# Altium schematic sheet rev02_4.SchDoc
size 409 x 282 mm
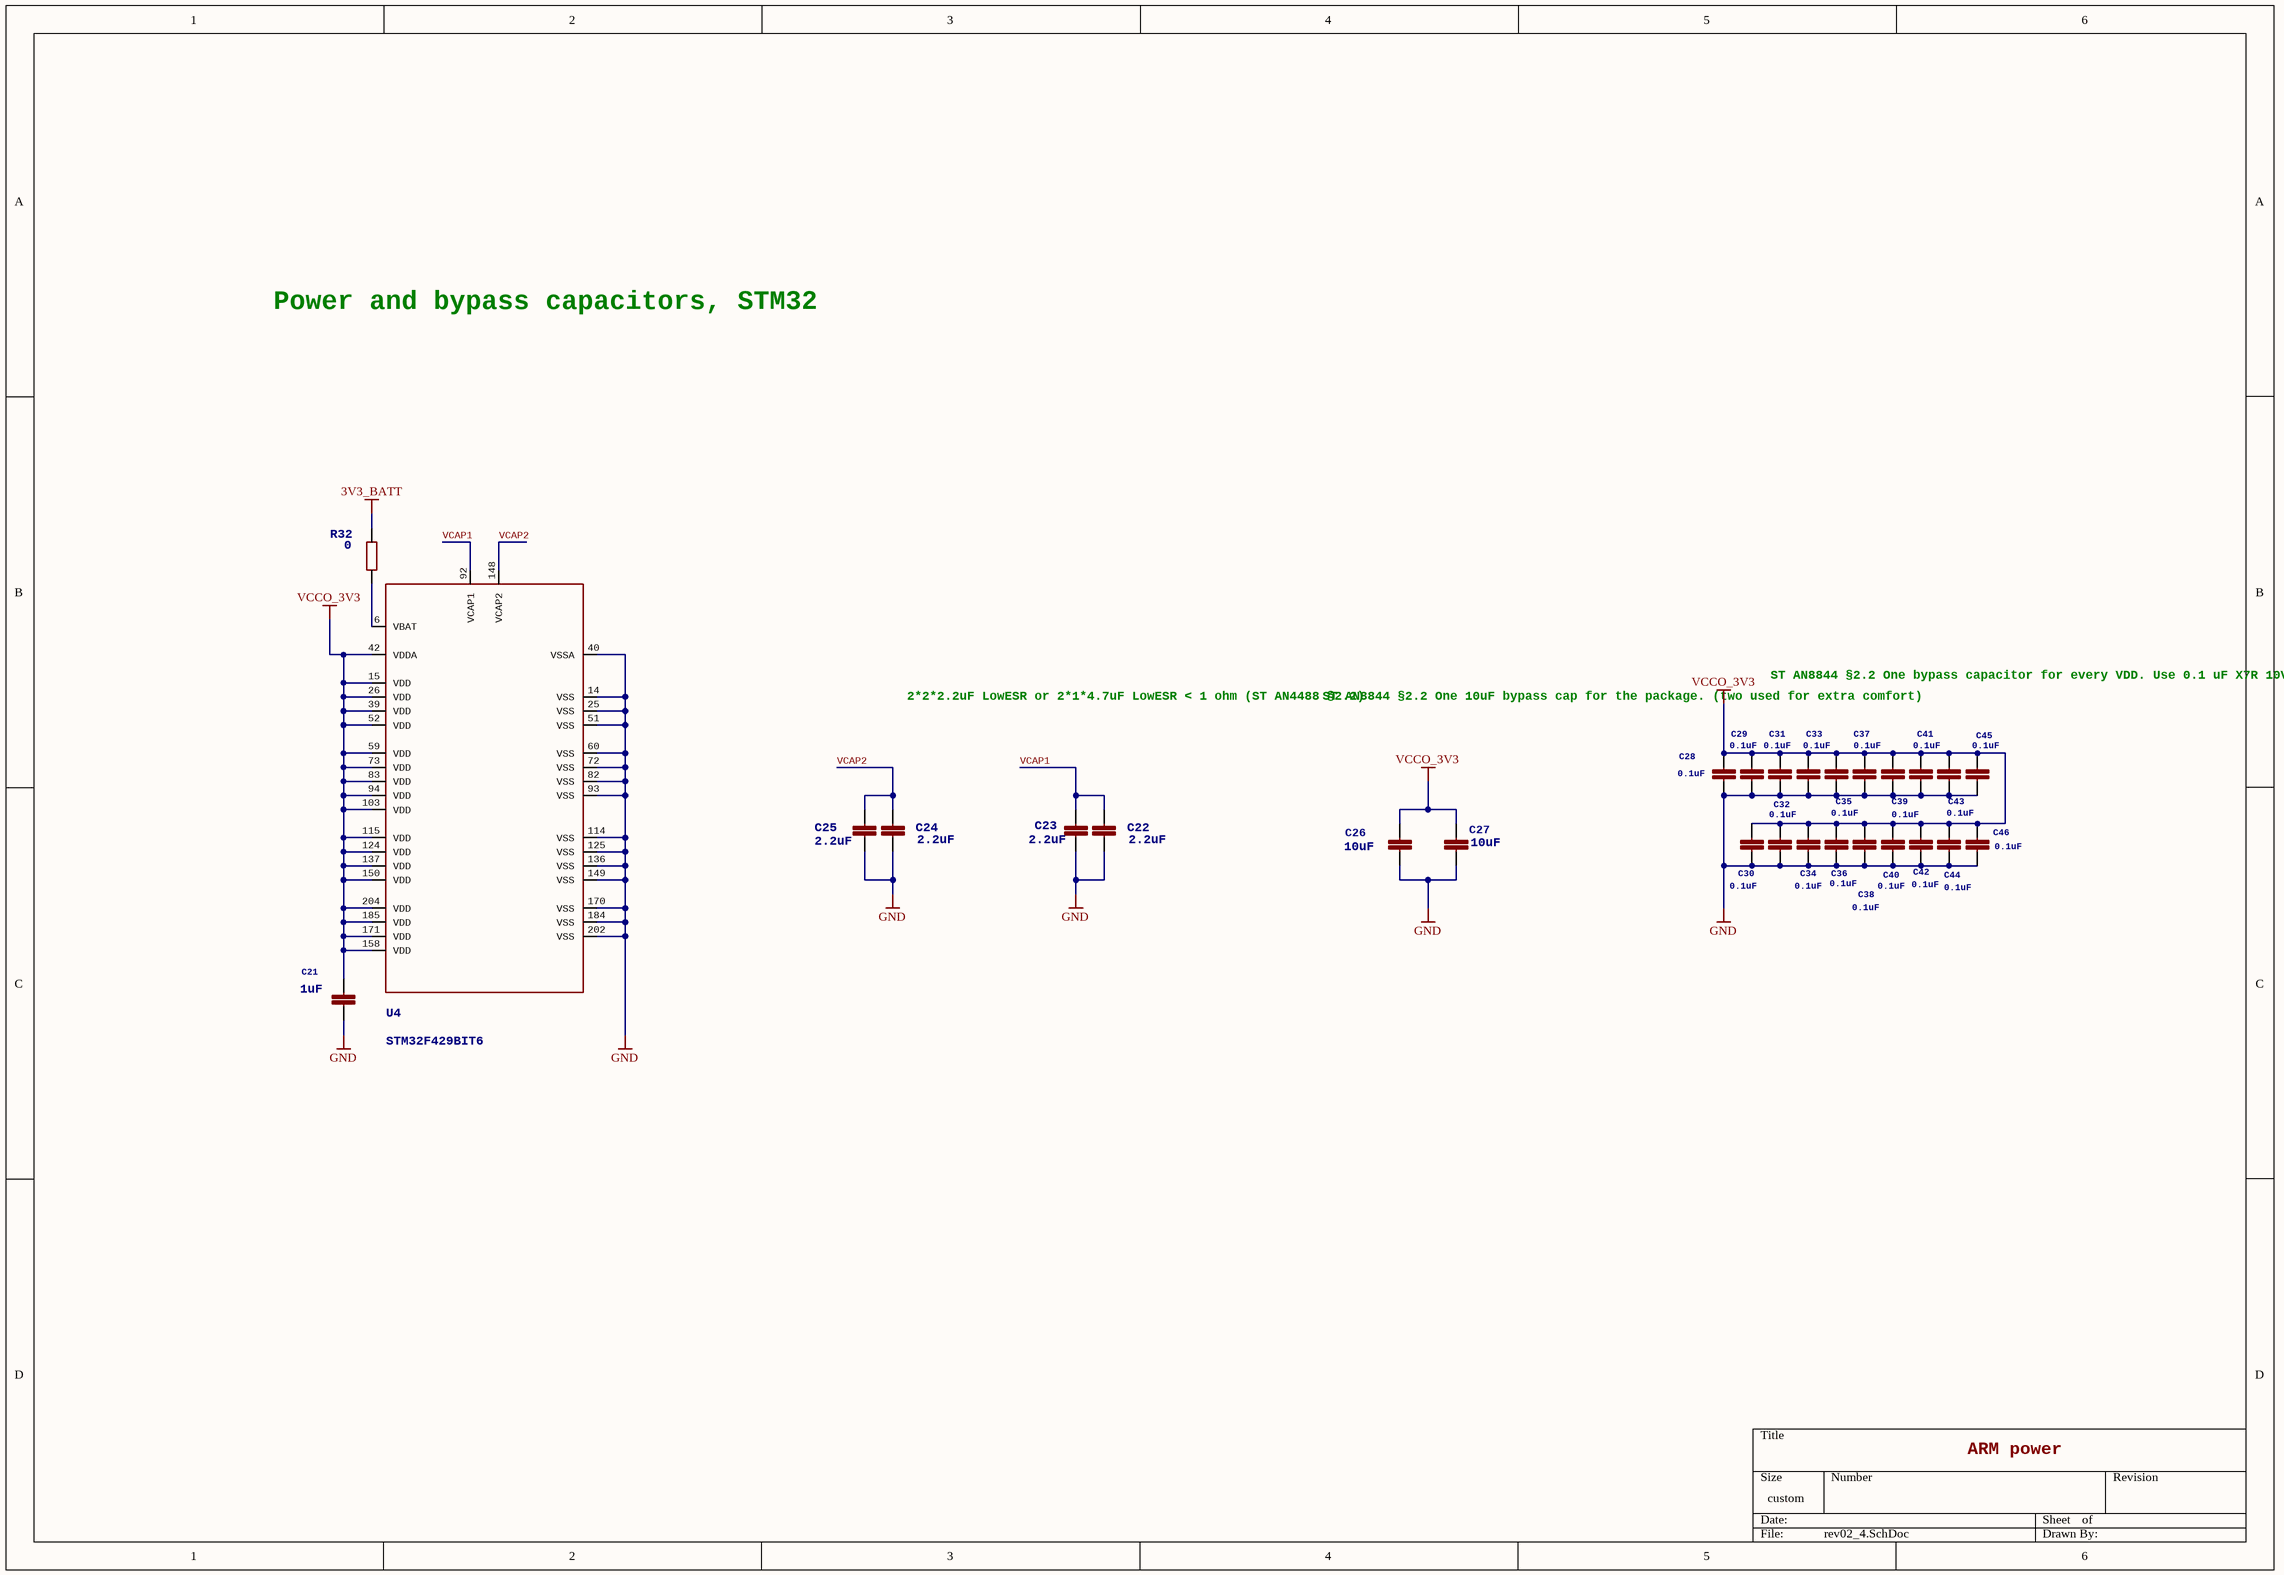
[diagram p0: rev02_4.SchDoc]

## Parts
C21  value 1uF  [C_0603]
C22  value 2.2uF  [C_0603]
C23  value 2.2uF  [C_0603]
C24  value 2.2uF  [C_0603]
C25  value 2.2uF  [C_0603]
C26  value 10uF  [C_0805]
C27  value 10uF  [C_0805]
C28  value 0.1uF  [C_0402]
C29  value 0.1uF  [C_0402]
C30  value 0.1uF  [C_0402]
C31  value 0.1uF  [C_0402]
C32  value 0.1uF  [C_0402]
C33  value 0.1uF  [C_0402]
C34  value 0.1uF  [C_0402]
C35  value 0.1uF  [C_0402]
C36  value 0.1uF  [C_0402]
C37  value 0.1uF  [C_0402]
C38  value 0.1uF  [C_0402]
C39  value 0.1uF  [C_0402]
C40  value 0.1uF  [C_0402]
C41  value 0.1uF  [C_0402]
C42  value 0.1uF  [C_0402]
C43  value 0.1uF  [C_0402]
C44  value 0.1uF  [C_0402]
C45  value 0.1uF  [C_0402]
C46  value 0.1uF  [C_0402]
R32  value 0  [R_0402]
U4  >NAME: U4  (hidden comment: STM32F429BIT6)  (part C of 4)

## Nets
3V3_BATT: R32.1
GND: C21.2 C22.1 C23.1 C24.1 C25.1 C26.2 C27.2 C28.2 C29.2 C30.2 C31.2 C32.2 C33.2 C34.2 C35.2 C36.2 C37.2 C38.2 C39.2 C40.2 C41.2 C42.2 C43.2 C44.2 C45.2 C46.2 U4.14(VSS) U4.25(VSS) U4.40(VSSA) U4.51(VSS) U4.60(VSS) U4.72(VSS) U4.82(VSS) U4.93(VSS) U4.114(VSS) U4.125(VSS) U4.136(VSS) U4.149(VSS) U4.170(VSS) U4.184(VSS) U4.202(VSS)
VCCO_3V3: C21.1 C26.1 C27.1 C28.1 C29.1 C30.1 C31.1 C32.1 C33.1 C34.1 C35.1 C36.1 C37.1 C38.1 C39.1 C40.1 C41.1 C42.1 C43.1 C44.1 C45.1 C46.1 U4.15(VDD) U4.26(VDD) U4.39(VDD) U4.42(VDDA) U4.52(VDD) U4.59(VDD) U4.73(VDD) U4.83(VDD) U4.94(VDD) U4.103(VDD) U4.115(VDD) U4.124(VDD) U4.137(VDD) U4.150(VDD) U4.158(VDD) U4.171(VDD) U4.185(VDD) U4.204(VDD)
VCAP1: C22.2 C23.2 U4.92(VCAP1)
VCAP2: C24.2 C25.2 U4.148(VCAP2)
NetR32_2: R32.2 U4.6(VBAT)

## Notes on the sheet
- Power and bypass capacitors, STM32
- ST AN8844 §2.2
  One bypass capacitor for every VDD.
  Use 0.1 uF X7R 10V.
- 2*2*2.2uF LowESR or
  2*1*4.7uF LowESR
  < 1 ohm
  (ST AN4488 §2.2)
- ST AN8844 §2.2
  One 10uF bypass cap for the package.
  (two used for extra comfort)
- ARM power

## Library data of the parts
C21-C25 = C-EUC0603: 0603 CAPACITOR
C26 C27 = C-EUC0805: 0805 CAPACITOR
C28-C46 = C-EUC0402: 0402 CAPACITOR
R32 = R-EU_R0402: 0402 Resistor 5%
U4 = STM32F429BIT6: STM32F429 Cortex-M4 CPU / 180 MHz, 256 KB RAM, 2 MB Flash; OC_FARNELL: 2469581; >VALUE: STM32F429BIT6